# EAGLE design thaw (EAGLE 5.11)
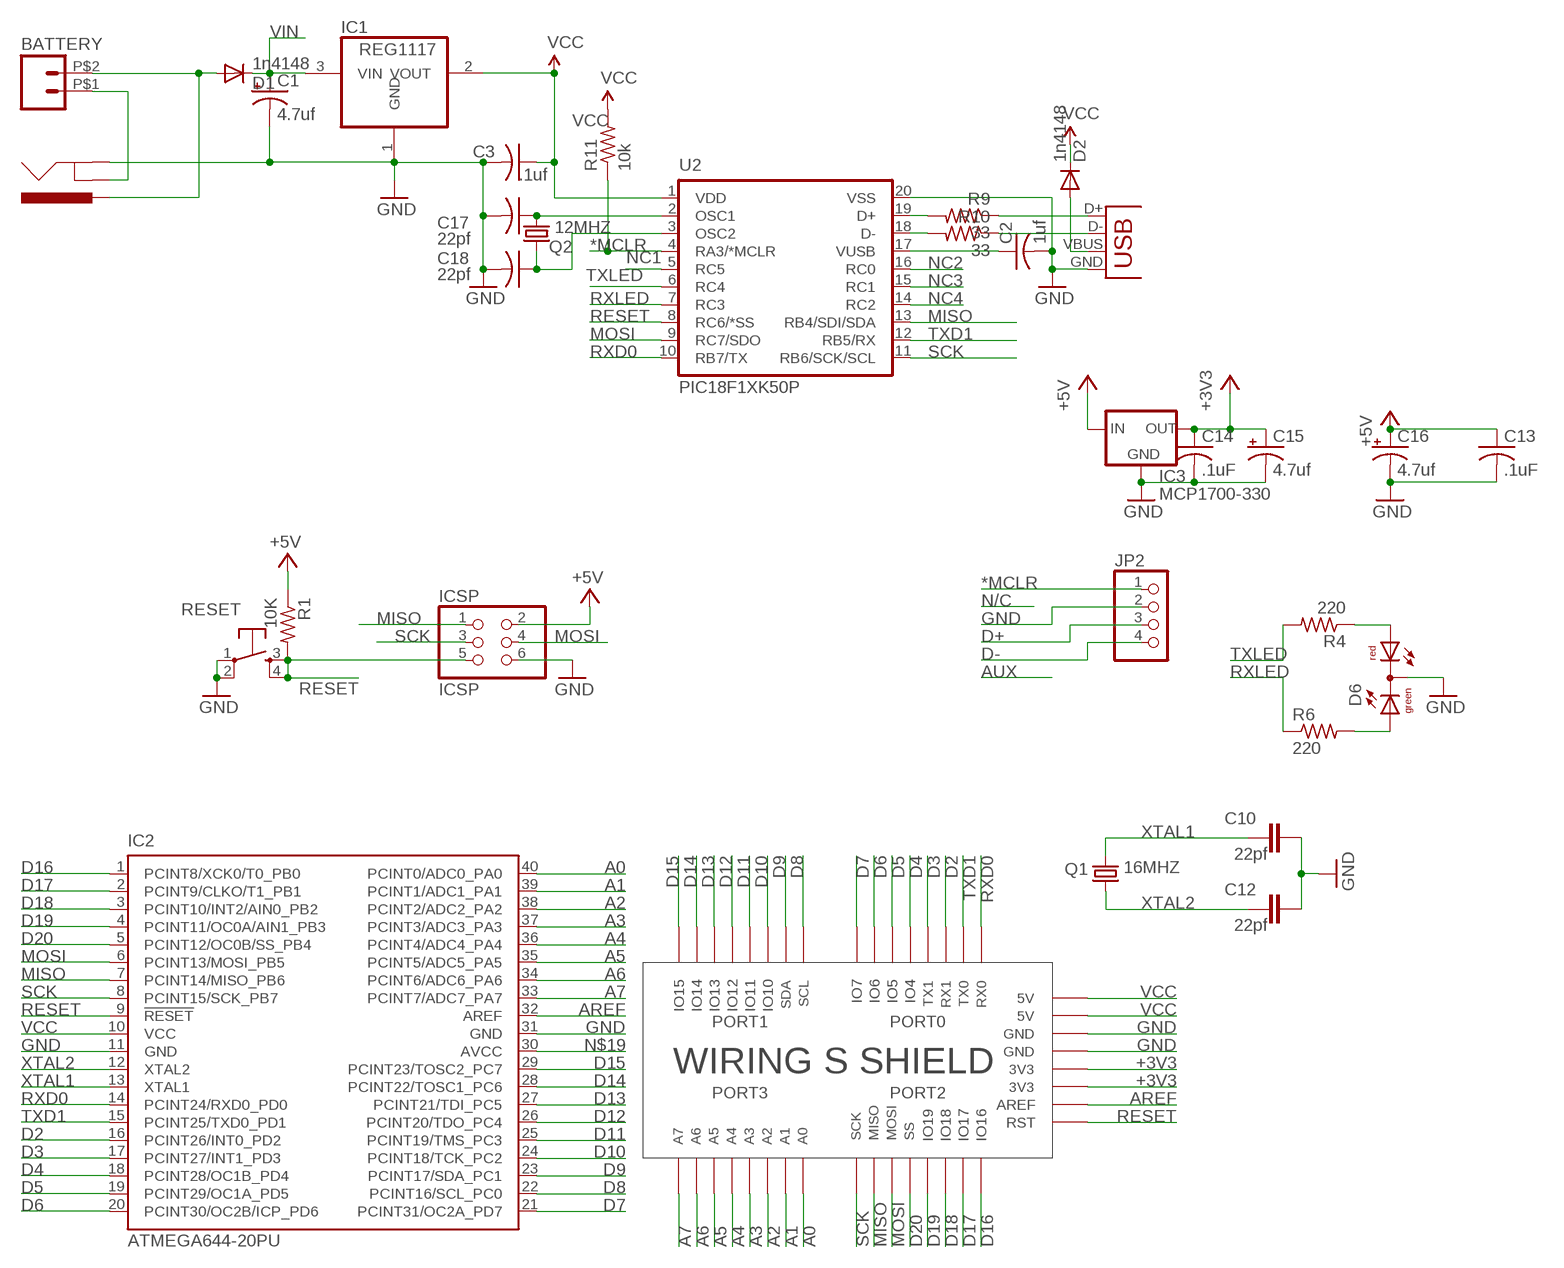
[diagram p0: schematic, sheet 1]

## Parts
BATTERY  M02  [1X02_BIG]
C1  4.7uf  CPOL-USE2.5-5  [E2,5-5]
C2  1uf  C-US025-030X050  [C025-030X050]
C3  .1uf  C-US025-030X050  [C025-030X050]
C10  22pf  C-EU025-025X050  [C025-025X050]
C12  22pf  C-EU025-025X050  [C025-025X050]
C13  .1uF  C-US025-025X050  [C025-025X050]
C14  .1uF  C-US025-025X050  [C025-025X050]
C15  4.7uf  CPOL-USE2.5-5  [E2,5-5]
C16  4.7uf  CPOL-USE2.5-5  [E2,5-5]
C17  22pf  C-US025-030X050  [C025-030X050]
C18  22pf  C-US025-030X050  [C025-030X050]
D1  1n4148  DIODEPTH2  [DOIDE-1N4148]
D2  1n4148  DIODEPTH2  [DOIDE-1N4148]
D6  DUOLED2X5  [DUOLED2X5]
IC1  REG1117  [SOT223]
IC2  ATMEGA644-20PU  [DIL40]
IC3  MCP1700-330  MCP1700TRI  [TO92]
ICSP  ICSP  PINHD-2X3  [2X03]
J1  POWER_JACKPTH  [POWER_JACK_PTH]
JP2  PINHD-1X4  [1X04]
Q1  16MHZ  CRYSTALHC49S  [HC49/S]
Q2  12MHZ  CRYSTALHC49S  [HC49/S]
R1  10K  R-US_0204/5  [0204/5]
R4  220  R-US_0204/5  [0204/5]
R6  220  R-US_0204/5  [0204/5]
R9  33  R-US_0204/5  [0204/5]
R10  33  R-US_0204/5  [0204/5]
R11  10k  R-US_0204/5  [0204/5]
RESET  TAC_SWITCHPTH  [TACTILE-PTH]
U2  PIC18F1XK50P  PIC18F/LF1XK50P  [DIL20]
U$1  WIRINGSHIELD  [WIRINGSHIELD]
X3  USB-3DPTH  [USB-B-PTH]

## Nets
*MCLR: JP2.1 R11.1 U2.4(RA3/*MCLR)
+3V3: C14.1 C15.+ IC3.3(OUT) U$1.P$37(3V3) U$1.P$38(3V3)
A0: IC2.40(PCINT0/ADC0_PA0) U$1.P$25(IO24)
A1: IC2.39(PCINT1/ADC1_PA1) U$1.P$26(IO25)
A2: IC2.38(PCINT2/ADC2_PA2) U$1.P$27(IO26)
A3: IC2.37(PCINT3/ADC3_PA3) U$1.P$28(IO27)
A4: IC2.36(PCINT4/ADC4_PA4) U$1.P$29(IO28)
A5: IC2.35(PCINT5/ADC5_PA5) U$1.P$30(IO29)
A6: IC2.34(PCINT6/ADC6_PA6) U$1.P$31(IO30)
A7: IC2.33(PCINT7/ADC7_PA7) U$1.P$32(IO31)
AREF: IC2.32(AREF) U$1.P$39(AREF)
D2: IC2.16(PCINT26/INT0_PD2) U$1.P$3(IO2)
D3: IC2.17(PCINT27/INT1_PD3) U$1.P$4(IO3)
D4: IC2.18(PCINT28/OC1B_PD4) U$1.P$5(IO4)
D5: IC2.19(PCINT29/OC1A_PD5) U$1.P$6(IO5)
D6: IC2.20(PCINT30/OC2B/ICP_PD6) U$1.P$7(IO6)
D7: IC2.21(PCINT31/OC2A_PD7) U$1.P$8(IO7)
D8: IC2.22(PCINT16/SCL_PC0) U$1.P$9(IO8)
D9: IC2.23(PCINT17/SDA_PC1) U$1.P$10(IO9)
D10: IC2.24(PCINT18/TCK_PC2) U$1.P$11(IO10)
D11: IC2.25(PCINT19/TMS_PC3) U$1.P$12(IO11)
D12: IC2.26(PCINT20/TDO_PC4) U$1.P$13(IO12)
D13: IC2.27(PCINT21/TDI_PC5) U$1.P$14(IO13)
D14: IC2.28(PCINT22/TOSC1_PC6) U$1.P$15(IO14)
D15: IC2.29(PCINT23/TOSC2_PC7) U$1.P$16(IO15)
D16: IC2.1(PCINT8/XCK0/T0_PB0) U$1.P$17(IO16)
D17: IC2.2(PCINT9/CLKO/T1_PB1) U$1.P$18(IO17)
D18: IC2.3(PCINT10/INT2/AIN0_PB2) U$1.P$19(IO18)
D19: IC2.4(PCINT11/OC0A/AIN1_PB3) U$1.P$20(IO19)
D20: IC2.5(PCINT12/OC0B/SS_PB4) U$1.P$21(IO20)
D+: JP2.3 R9.2 U2.19(D+)
D-: JP2.4 R10.2 U2.18(D-)
GND: C1.- C2.2 C3.2 C10.1 C12.1 C13.2 C14.2 C15.- C16.- C17.2 C18.2 D6.K(C) IC1.1(GND) IC2.11(GND) IC2.31(GND) IC3.1(GND) ICSP.6 J1.GND JP2.2 RESET.1 RESET.2 U2.20(VSS) U$1.P$35(GND) U$1.P$36(GND) X3.GND
MISO: IC2.7(PCINT14/MISO_PB6) ICSP.1 U2.13(RB4/SDI/SDA) U$1.P$23(IO22)
MOSI: IC2.6(PCINT13/MOSI_PB5) ICSP.4 U2.9(RC7/SDO) U$1.P$22(IO21)
N$1: BATTERY.P$2 D1.A J1.PWR
N$2: D6.AR R4.1
N$3: C2.1 U2.17(VUSB)
N$8: R9.1 X3.D+
N$9: R10.1 X3.D-
N$10: C17.1 Q2.2 U2.2(OSC1)
N$11: D2.A X3.VBUS
N$12: BATTERY.P$1 J1.GNDBREAK
N$14: D6.AG R6.2
N$15: C18.1 Q2.1 U2.3(OSC2)
N$19: IC2.30(AVCC)
NC1: U2.5(RC5)
NC2: U2.16(RC0)
NC3: U2.15(RC1)
NC4: U2.14(RC2)
RESET: IC2.9(!RESET) ICSP.5 R1.2 RESET.3 RESET.4 U2.8(RC6/*SS) U$1.P$40(RST)
RXD0: IC2.14(PCINT24/RXD0_PD0) U2.10(RB7/TX) U$1.P$1(IO0)
RXLED: R6.1 U2.7(RC3)
SCK: IC2.8(PCINT15/SCK_PB7) ICSP.3 U2.11(RB6/SCK/SCL) U$1.P$24(IO23)
TXD1: IC2.15(PCINT25/TXD0_PD1) U2.12(RB5/RX) U$1.P$2(IO1)
TXLED: R4.2 U2.6(RC4)
VCC: C3.1 C13.1 C16.+ D2.C IC1.2(VOUT) IC2.10(VCC) IC3.2(IN) ICSP.2 R1.1 R11.2 U2.1(VDD) U$1.P$33(5V) U$1.P$34(5V) ; supply symbol labelled +5V
VIN: C1.+ D1.C IC1.3(VIN)
XTAL1: C10.2 IC2.13(XTAL1) Q1.2
XTAL2: C12.2 IC2.12(XTAL2) Q1.1

## Library data of the parts
BATTERY = 3d:M02: Header 2 Standard 2-pin 0.1" header. Use with straight break away headers (SKU : PRT-00116), right angle break away headers (PRT-00553), swiss pins (PRT-00743), machine pins (PRT-00117), and female headers (PRT-00115). Molex polarized connector foot print use with SKU : PRT-08233 with associated crimp pins and housings.
C1 C15 C16 = adafruit:CPOL-US: POLARIZED CAPACITOR, American symbol
C2 C3 C17 C18 = rcl:C-US: CAPACITOR, American symbol
C10 C12 = SmartPrj:C-EU: CAPACITOR, European symbol
C13 C14 = adafruit:C-US: CAPACITOR, American symbol
D1 D2 = 3d:DIODE: Diode These are standard reverse protection diodes and small signal diodes. SMA package can handle up to about 1A. SOD-323 can handle about 200mA. What the SOD-323 package when ordering, there are some mfgs out there that are 5-pin packages.
D6 = led:DUOLED2X5: DUO LED 2 colors, 2.5 x 5 mm, recangle
IC1 = burr-brown:REG1117: 800mA and 1A Low Dropout (LDO) Positive Regulator 1.8V, 2.5V, 2.85V, 3.3V, 5V, and Adj; MPN: REG1117; OC_FARNELL: 1097566; OC_NEWARK: 14P6981
IC2 = atmel:ATMEGA644-*PU: 8-bit Microcontroller with 64K Bytes In-System Programmable Flash Auto generated by make-symbol-device-package-bsdl.ulp Rev. 34 Source: http://www.atmel.com/dyn/resources/prod_documents/doc2593.pdf; MPN: ATMEGA644-20PU; OC_FARNELL: 1288340; OC_NEWARK: 23M5060
IC3 = adafruit:MCP1700: VOLTAGE REGULATOR
ICSP = pinhead:PINHD-2X3: PIN HEADER
J1 = 3d:POWER_JACK: Power Jack This is the standard 5.5mm barrel jack for power. The PTH is the most common, proven, reliable, footprint. All others are experimental. The Slot footprint only works if the mill layer is transmitted to the PCB fab house so be warned. Spark Fun Electronics SKU : PRT-00119. Mating wall wart : TOL-00298 (and others)
JP2 = 3d2010:PINHD-1X4: PIN HEADER
Q1 Q2 = crystal:CRYSTAL: CRYSTAL
R1 R4 R6 = adafruit:R-US_: RESISTOR, American symbol
R9 R10 = rcl:R-US_: RESISTOR, American symbol
R11 = resistor:R-US_: RESISTOR, American symbol
RESET = 3d:TAC_SWITCH: Momentary Switch Button commonly used for reset or general input. Spark Fun Electronics SKU : COM-00097
U2 = mcp2200plus:PIC18F/LF1XK50: 20 pin USB flash Microcontroller.
U$1 = 3d2011:WIRINGSHIELD: Wiring S Shield
X3 = 3d2010:USB-3D: USB Connectors USB-B-PTH is fully proven SKU : PRT-00139 USB-miniB is fully proven SKU : PRT-00587 USB-A-PCB is untested. USB-A-H is throughly reviewed, but untested. Spark Fun Electronics SKU : PRT-00437 USB-B-SMT is throughly reviewed, but untested. Needs silkscreen touching up. USB-A-S has not been used/tested USB-MB-H has not been used/tested

## Net classes
0 default: width 0.203 mm
1 vcc: width 0.254 mm

## Board
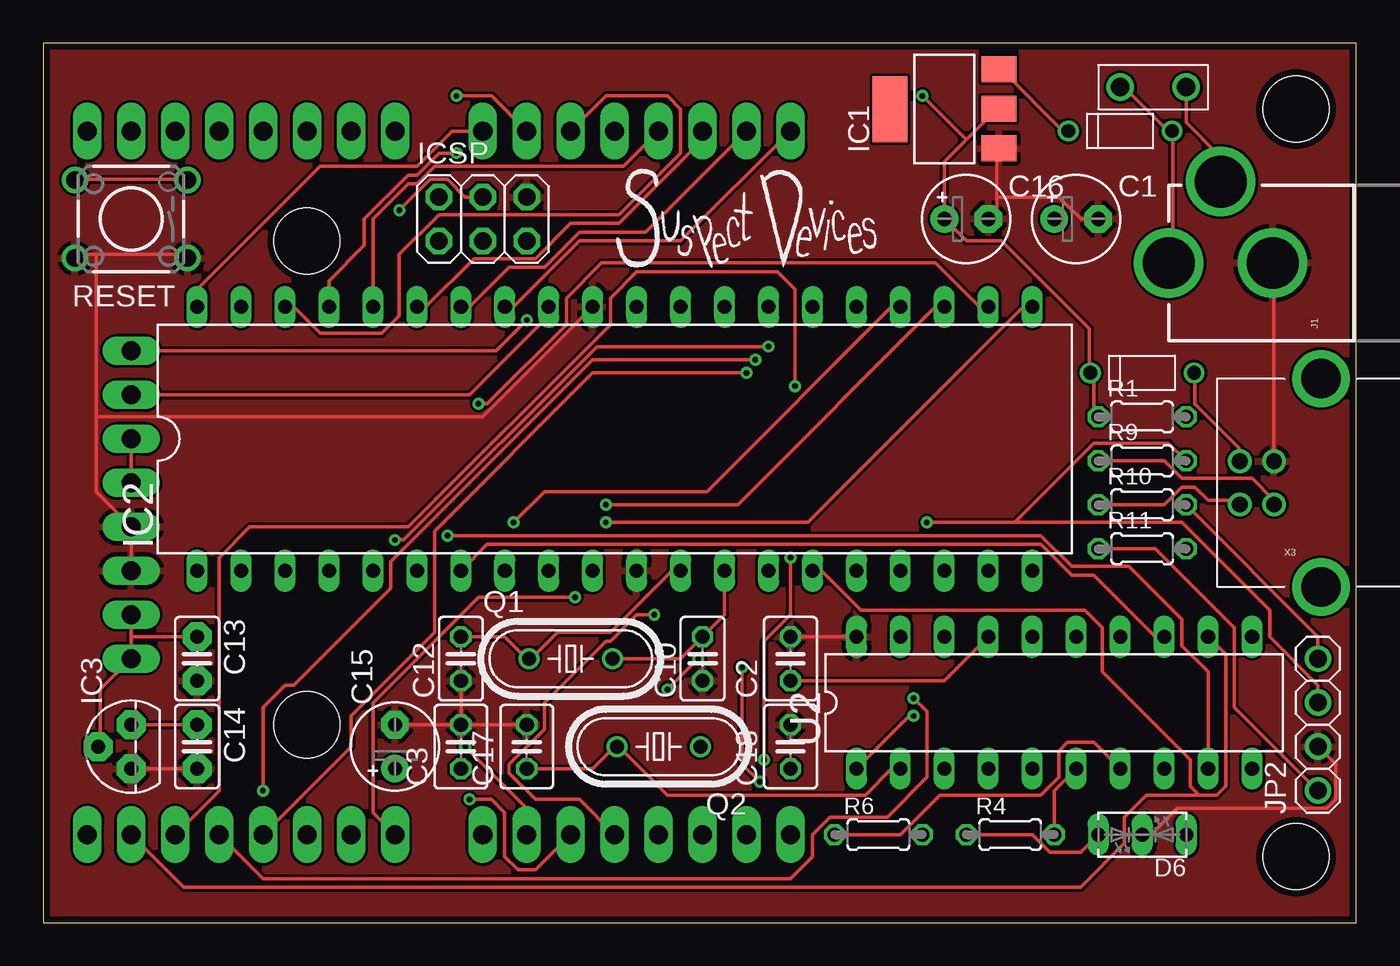
[diagram p1: board, top side]
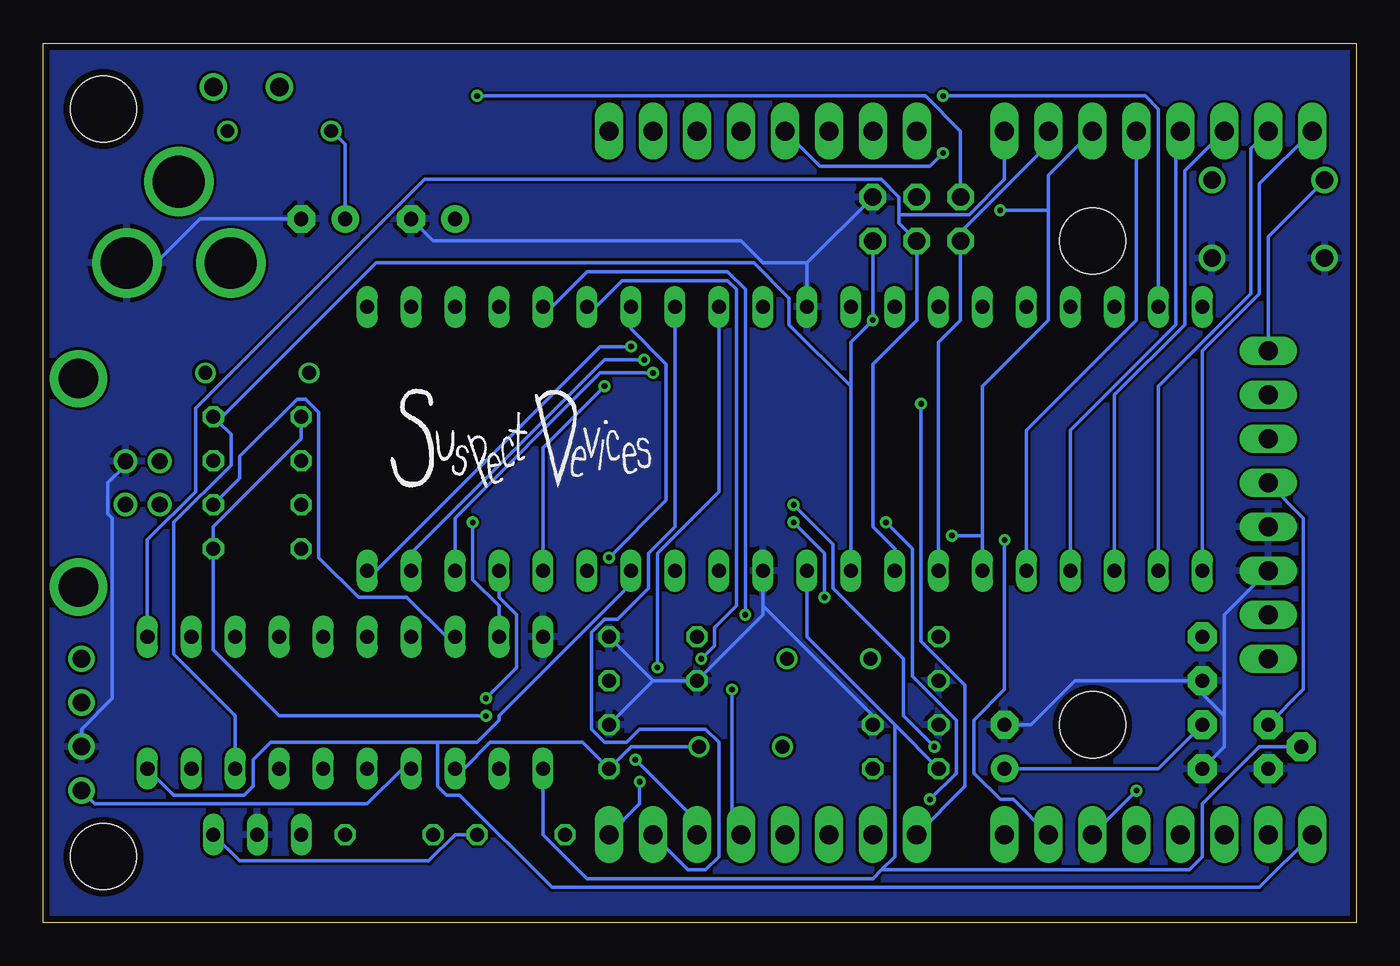
[diagram p2: board, bottom side, seen from below]

Size 75.87 x 50.79 mm. Coordinates in mm from the lower left corner, seen from the top.
Outline: 0,0 75.87,0 75.87,50.79 0,50.79 0,0
Copper layers (1*16): Top 0.0356mm / dielectric 1.5011mm / Bottom 0.0356mm
Design rules "LaenPCBOrder": minimum track width 6mil, minimum drill 13mil, track to track 6mil, track to pad 6mil, pad to pad 6mil, via to via 6mil, smd to smd 6mil, copper to edge 15mil, drill to drill 6mil, minimum pad ring 7mil, minimum via ring 7mil, stop-mask expansion 4mil, vias tented up to drill 0mil, thermal gap 10mil

### Footprints (pad centres in the part's own frame; a part is rotated, then mirrored left to right if it is on the bottom)
1X02_BIG = drill 1.067 round: P$1 0,0; P$2 3.81,0
E2,5-5 = drill 0.813 pad 1.6 round: + -1.27,0 | drill 0.813 pad 1.6 octagon: - 1.27,0
C025-030X050 = drill 0.813 octagon: 1 -1.27,0; 2 1.27,0
C025-025X050 = drill 0.813 octagon: 1 -1.27,0; 2 1.27,0
C025-025X050' = drill 0.813 pad 1.676 octagon: 1 -1.27,0; 2 1.27,0
DOIDE-1N4148 = drill 0.8 round: A 3,0; C -3,0
DUOLED2X5 = drill 0.813 long: AG -2.54,0; AR 2.54,0; K 0,0
SOT223 = smd 1.499 x 2.007: 1 -2.261,-3.15; 2 0.025,-3.15; 3 2.311,-3.15 | smd 3.81 x 2.007: 4 0,3.15
DIL40 = drill 0.813 long: 1 -24.13,-7.62; 2 -21.59,-7.62; 3 -19.05,-7.62; 4 -16.51,-7.62; 5 -13.97,-7.62; 6 -11.43,-7.62; 7 -8.89,-7.62; 8 -6.35,-7.62; 9 -3.81,-7.62; 10 -1.27,-7.62; 11 1.27,-7.62; 12 3.81,-7.62; 13 6.35,-7.62; 14 8.89,-7.62; 15 11.43,-7.62; 16 13.97,-7.62; 17 16.51,-7.62; 18 19.05,-7.62; 19 21.59,-7.62; 20 24.13,-7.62; 21 24.13,7.62; 22 21.59,7.62; 23 19.05,7.62; 24 16.51,7.62; 25 13.97,7.62; 26 11.43,7.62; 27 8.89,7.62; 28 6.35,7.62; 29 3.81,7.62; 30 1.27,7.62; 31 -1.27,7.62; 32 -3.81,7.62; 33 -6.35,7.62; 34 -8.89,7.62; 35 -11.43,7.62; 36 -13.97,7.62; 37 -16.51,7.62; 38 -19.05,7.62; 39 -21.59,7.62; 40 -24.13,7.62
TO92 = drill 0.813 pad 1.676 octagon: 1 -1.27,0; 2 0,1.905; 3 1.27,0
2X03 = drill 1.016 octagon: 1 -2.54,-1.27; 2 -2.54,1.27; 3 0,-1.27; 4 0,1.27; 5 2.54,-1.27; 6 2.54,1.27
POWER_JACK_PTH = drill 2.997 round: GND 0,7.7; GNDBREAK 4.7,10.7; PWR 0,13.7
1X04 = drill 1.016 round: 1 -3.81,0; 2 -1.27,0; 3 1.27,0; 4 3.81,0
HC49/S = drill 0.813 round: 1 -2.413,0; 2 2.413,0
0204/5 = drill 0.813 octagon: 1 -2.54,0; 2 2.54,0
TACTILE-PTH = drill 1.016 round: 1 -3.251,2.261; 2 3.251,2.261; 3 -3.251,-2.261; 4 3.251,-2.261
DIL20 = drill 0.813 long: 1 -11.43,-3.81; 2 -8.89,-3.81; 3 -6.35,-3.81; 4 -3.81,-3.81; 5 -1.27,-3.81; 6 1.27,-3.81; 7 3.81,-3.81; 8 6.35,-3.81; 9 8.89,-3.81; 10 11.43,-3.81; 11 11.43,3.81; 12 8.89,3.81; 13 6.35,3.81; 14 3.81,3.81; 15 1.27,3.81; 16 -1.27,3.81; 17 -3.81,3.81; 18 -6.35,3.81; 19 -8.89,3.81; 20 -11.43,3.81
WIRINGSHIELD = drill 1.1 pad 1.422 long: P$1 2.54,5.08; P$2 5.08,5.08; P$3 7.62,5.08; P$4 10.16,5.08; P$5 12.7,5.08; P$6 15.24,5.08; P$7 17.78,5.08; P$8 20.32,5.08; P$9 25.4,5.08; P$10 27.94,5.08; P$11 30.48,5.08; P$12 33.02,5.08; P$13 35.56,5.08; P$14 38.1,5.08; P$15 40.64,5.08; P$16 43.18,5.08; P$17 2.54,45.72; P$18 5.08,45.72; P$19 7.62,45.72; P$20 10.16,45.72; P$21 12.7,45.72; P$22 15.24,45.72; P$23 17.78,45.72; P$24 20.32,45.72; P$25 25.4,45.72; P$26 27.94,45.72; P$27 30.48,45.72; P$28 33.02,45.72; P$29 35.56,45.72; P$30 38.1,45.72; P$31 40.64,45.72; P$32 43.18,45.72; P$33 5.08,15.24; P$34 5.08,17.78; P$35 5.08,20.32; P$36 5.08,22.86; P$37 5.08,25.4; P$38 5.08,27.94; P$39 5.08,30.48; P$40 5.08,33.02 | hole 3.81: 15.24,11.43; 15.24,39.37; 72.39,46.99; 72.39,3.81
USB-B-PTH = drill 0.914 round: D+ 0,1.25; D- 1.981,1.25; GND 0,-1.25; VBUS 1.981,-1.25 | drill 2.286 round: P$1 -2.718,-6.02; P$2 -2.718,6.02

### Placement (x,y rotation side)
BATTERY  66.04,48.26 180 top
C1  59.69,40.64 0 top
C2  43.18,15.24 90 top
C3  24.13,10.16 90 top
C10  38.1,15.24 90 top
C12  24.13,15.24 90 top
C13  .1uF  [C025-025X050']  8.89,15.24 270 top
C14  .1uF  [C025-025X050']  8.89,10.16 270 top
C15  20.32,10.16 90 top
C16  53.34,40.64 0 top
C17  27.94,10.16 90 top
C18  43.18,10.16 90 top
D1  62.23,45.72 0 top
D2  63.5,31.75 0 top
D6  63.5,5.08 180 top
IC1  52.07,46.99 90 top
IC2  33.02,27.94 0 top
IC3  5.08,10.16 90 top
ICSP  25.4,40.64 0 top
J1  78.74,38.1 90 top
JP2  73.66,11.43 90 top
Q1  30.48,15.24 0 top
Q2  35.56,10.16 180 top
R1  63.5,29.21 0 top
R4  55.88,5.08 0 top
R6  48.26,5.08 0 top
R9  63.5,26.67 0 top
R10  63.5,24.13 0 top
R11  63.5,21.59 0 top
RESET  5.08,40.64 180 top
U2  58.42,12.7 0 top
U$1  0,0 0 top
U$2  [SUSDEVLOGOSM]  33.02,38.1 0 top
U$3  [SUSDEVLOGOSM]  55.88,25.4 0 bottom
X3  71.12,25.4 180 top

### Tracks (layer width: path | path; a pad name or v marks a point on that pad's centre or on a via)
*MCLR
  Top 0.203: R11.1 64.26,21.59 68.83,17.02 68.83,12.45 JP2.1
  Bottom 0.203: U2.4 55.12,8.89 57.15,6.86 72.9,6.86 JP2.1
+3V3
  Top 0.203: U$1.P$37 U$1.P$38 | IC3.3 C14.1
  Bottom 0.203: C15.+ 11.43,8.89 C14.1 | U$1.P$37 3.05,23.37 3.05,13.46 IC3.3
A0
  Top 0.203: IC2.40 8.89,36.58 16,43.69 21.59,43.69 23.62,45.72 U$1.P$25
A1  (via drill 0.33)
  Top 0.203: v23.88,47.75 25.91,47.75 U$1.P$26
  Bottom 0.203: IC2.39 11.43,46.99 12.19,47.75 v23.88,47.75
A2
  Top 0.203: IC2.38 14.48,35.56 16,34.04 19.56,34.04 20.57,35.05 20.57,38.61 22.86,40.89 33.27,40.89 36.83,44.45 36.83,46.99 36.07,47.75 32.51,47.75 U$1.P$27
A3  (via drill 0.33)
  Top 0.203: IC2.37 16.51,37.08 18.54,39.12 18.54,40.64 21.08,43.18 21.59,43.18 22.86,44.45 v23.88,44.45
  Bottom 0.203: v23.88,44.45 24.64,43.69 30.99,43.69 U$1.P$28
A4
  Top 0.203: IC2.36 19.05,40.64 21.08,42.67 21.59,42.67 22.61,43.69 33.53,43.69 U$1.P$29
A5
  Top 0.203: IC2.35 22.1,35.56 24.89,38.35 28.45,38.35 30.48,40.39 33.27,40.39 38.1,45.21 U$1.P$30
A6
  Top 0.203: IC2.34 24.64,35.56 26.92,37.85 28.96,37.85 30.99,39.88 34.8,39.88 U$1.P$31
A7
  Top 0.203: IC2.33 27.18,35.56 30.99,39.37 36.83,39.37 U$1.P$32
AREF
  Top 0.203: IC2.32 29.21,35.05 24.64,30.48 U$1.P$39
D2  (via drill 0.33)
  Top 0.203: v43.43,30.99 43.43,36.58 42.42,37.59 34.29,37.59 32.77,36.07 32.77,34.54 21.08,22.86 11.94,22.86 10.16,21.08 10.16,7.62 U$1.P$3
  Bottom 0.203: IC2.16 46.99,27.43 v43.43,30.99
D3  (via drill 0.33)
  Top 0.203: v50.29,12.95 51.05,12.19 51.05,8.38 48.77,6.1 45.47,6.1 44.45,5.08 44.45,3.81 43.18,2.54 12.7,2.54 U$1.P$4
  Bottom 0.203: IC2.17 49.53,18.8 48.51,17.78 48.51,14.73 v50.29,12.95
D4  (via drill 0.33)
  Top 0.203: v40.64,31.75 31.75,31.75 22.61,22.61 22.61,16.76 17.78,11.94 17.78,10.16 U$1.P$5
  Bottom 0.203: IC2.18 52.07,23.37 43.69,31.75 v40.64,31.75
D5  (via drill 0.33)
  Top 0.203: v41.15,32.51 31.75,32.51 20.07,20.83 20.07,19.3 14.48,13.72 13.97,13.72 12.7,12.45 v12.7,7.62
  Bottom 0.203: IC2.19 54.61,21.34 43.43,32.51 v41.15,32.51 | U$1.P$6 v12.7,7.62
D6  (via drill 0.33)
  Top 0.203: v41.91,33.27 32,33.27 20.83,22.1 v20.32,22.1
  Bottom 0.203: IC2.20 56.64,20.32 43.69,33.27 v41.91,33.27 | v20.32,22.1 20.32,13.46 22.1,11.68 22.1,8.64 20.57,7.11 19.81,7.11 U$1.P$7
D7  (via drill 0.33)
  Top 0.203: IC2.21 56.64,35.56 44.2,23.11 v32.51,23.11 | v30.73,18.8 25.15,18.8 19.05,12.7 19.05,6.35 U$1.P$8
  Bottom 0.203: v32.51,23.11 30.73,21.34 v30.73,18.8
D8  (via drill 0.33)
  Top 0.203: IC2.22 54.1,35.56 51.56,38.1 32.26,38.1 30.23,36.07 30.23,34.54 25.65,29.97 v25.15,29.97
  Bottom 0.203: v25.15,29.97 25.15,16.26 22.61,13.72 22.61,7.87 U$1.P$9
D9  (via drill 0.33)
  Top 0.203: IC2.23 51.56,35.56 40.13,24.13 v32.51,24.13 | v24.38,10.16 27.94,6.6 U$1.P$10
  Bottom 0.203: v32.51,24.13 30.23,21.84 30.23,19.3 26.16,15.24 26.16,11.94 v24.38,10.16
D10  (via drill 0.33)
  Top 0.203: IC2.24 49.02,35.56 38.35,24.89 28.96,24.89 v27.18,23.11 | v24.64,7.11 25.91,7.11 26.67,6.35 26.67,3.81 27.43,3.05 28.45,3.05 U$1.P$11
  Bottom 0.203: v27.18,23.11 25.65,21.59 25.65,14.22 23.11,11.68 23.11,8.64 v24.64,7.11
D11  (via drill 0.33)
  Top 0.203: v35.31,17.78 34.29,17.78 32.77,16.26 32.51,16.26 28.96,12.7 28.96,11.18 26.92,9.14 26.92,8.64 28.45,7.11 30.99,7.11 U$1.P$12
  Bottom 0.203: IC2.25 46.48,35.56 44.45,37.59 36.32,37.59 35.31,36.58 v35.31,17.78
D12  (via drill 0.33)
  Top 0.203: v36.07,13.46 v37.85,15.24
  Bottom 0.203: IC2.26 43.94,35.56 42.42,37.08 36.32,37.08 35.81,36.58 35.81,18.29 37.08,17.02 37.08,16 v37.85,15.24 | v36.07,13.46 36.07,5.59 U$1.P$13
D13  (via drill 0.33)
  Top 0.203: v43.18,21.08 43.18,17.78 41.66,16.26 v41.66,9.4
  Bottom 0.203: IC2.27 41.91,34.29 39.88,32.26 39.88,24.38 v43.18,21.08 | v41.66,9.4 38.1,5.84 U$1.P$14
D14
  Bottom 0.203: IC2.28 39.37,22.86 40.89,21.34 40.89,19.3 42.67,17.53 43.43,17.53 44.2,16.76 44.2,11.18 43.43,10.41 42.16,10.41 41.4,11.18 37.59,11.18 36.83,10.41 36.83,3.81 37.59,3.05 38.61,3.05 U$1.P$15
D15  (via drill 0.33)
  Top 0.203: v40.39,14.73 40.39,9.14 v41.4,8.13
  Bottom 0.203: IC2.29 36.83,24.89 40.39,21.34 v40.39,14.73 | v41.4,8.13 41.4,6.86 U$1.P$16
D16
  Bottom 0.203: IC2.1 8.89,33.02 5.59,36.32 5.59,42.67 U$1.P$17
D17
  Bottom 0.203: IC2.2 11.43,30.99 6.1,36.32 6.1,44.7 U$1.P$18
D18
  Bottom 0.203: IC2.3 13.97,30.48 9.91,34.54 9.91,43.43 U$1.P$19
D19
  Bottom 0.203: IC2.4 16.51,28.45 10.41,34.54 10.41,45.47 U$1.P$20
D20
  Bottom 0.203: IC2.5 19.05,28.45 12.7,34.8 U$1.P$21
D+  (via drill 0.33)
  Top 0.203: v51.05,23.11 56.13,23.11 | 56.13,23.11 60.71,27.69 65.02,27.69 R9.2 | JP2.3 73.66,13.72 70.87,16.51 70.87,18.03 65.79,23.11 56.13,23.11
  Bottom 0.203: U2.19 49.53,18.29 51.05,19.81 v51.05,23.11
D-
  Top 0.203: JP2.4 73.66,16.51 R10.2
  Bottom 0.203: U2.18 52.58,16.51 54.86,18.8 57.66,18.8 59.94,21.08 59.94,29.46 60.71,30.23 61.21,30.23 64.52,26.92 64.52,25.65 R10.2
GND
  Top 0.203: C3.2 C12.1 | C3.2 C17.2 | C15.- C3.2 | C2.2 U2.20 | 3.05,38.61 8.13,38.61 RESET.1 | 3.05,38.61 2.03,38.61 RESET.2 | U$1.P$35 U$1.P$36 3.05,24.89 3.05,29.21 | IC3.1 C14.2 | 3.05,29.21 3.05,38.61 | 55.12,41.91 55.12,41.15 C16.- | 55.12,41.91 55.12,44.7 IC1.1 | C1.- 59.94,40.64 58.67,41.91 55.12,41.91 | D6.K 64.01,5.08 65.53,6.6 74.17,6.6 74.68,7.11 74.68,9.14 JP2.2 | X3.GND 71.12,38.1 J1.GND | 3.05,29.21 25.4,29.21 IC2.31
  Bottom 0.203: 40.64,13.97 C10.1 34.29,17.78 34.29,18.29 | 40.64,13.97 C2.2 | 40.64,13.97 C18.2 | 34.29,18.29 IC2.11 | C17.2 27.94,11.94 34.29,18.29 | 7.62,11.94 8.89,13.21 C13.2 16.26,13.97 18.8,11.43 C15.- | 7.62,11.94 7.62,10.16 C14.2 | U$1.P$35 7.62,17.78 7.62,11.94 | IC2.31 31.75,38.1 | 31.75,38.1 ICSP.6 | 31.75,38.1 34.29,38.1 35.56,39.37 53.34,39.37 C16.- | JP2.2 73.66,11.18 71.88,12.95 71.88,23.37 72.14,23.62 72.14,25.4 71.12,26.42 X3.GND | C1.- 66.8,40.64 69.34,38.1 J1.GND
  pour Bottom: 0,50.8 76.2,50.8 76.2,0 0,0
  pour Top: 0,50.8 76.2,50.8 76.2,0 0,0
MISO
  Top 0.203: U2.13 64.26,16.51 60.71,20.07 59.44,20.07 57.66,21.84 25.65,21.84 IC2.7
  Bottom 0.203: IC2.7 24.13,33.53 22.86,34.8 ICSP.1 22.86,39.88 17.78,44.96 U$1.P$23
MOSI  (via drill 0.33)
  Top 0.203: U2.9 67.31,14.48 65.79,16 65.79,17.53 62.74,20.57 59.44,20.57 57.66,22.35 v23.37,22.35 | ICSP.4 24.38,41.91 23.37,42.93 22.35,42.93 v20.57,41.15
  Bottom 0.203: 21.59,22.35 21.59,30.99 17.78,34.8 17.78,41.15 | IC2.6 21.59,22.35 | 17.78,41.15 17.78,43.18 U$1.P$22 | 21.59,22.35 v23.37,22.35 | 17.78,41.15 v20.57,41.15
N$1
  Top 0.203: BATTERY.P$2 62.48,48.26 65.02,45.72 D1.A 65.28,45.72 65.28,38.1 J1.PWR
N$2
  Top 0.203: R4.1 57.15,5.08 58.17,4.06 59.94,4.06 D6.AR
N$3
  Top 0.203: C2.1 52.07,13.97 U2.17
N$8
  Top 0.203: R9.1 64.77,26.67 65.79,25.65 69.85,25.65 71.12,24.38 X3.D+
N$9
  Top 0.203: R10.1 64.77,24.13 65.79,25.15 66.55,25.15 67.31,24.38 69.09,24.38 X3.D-
N$10
  Top 0.203: C17.1 31.75,8.89 33.02,10.16 Q2.2 33.27,10.16 36.07,7.37 47.5,7.37 49.02,8.89 U2.2
N$11
  Top 0.203: D2.A 66.55,31.75 66.55,29.97 69.09,27.43 69.09,26.67 X3.VBUS
N$12
  Top 0.203: BATTERY.P$1 66.04,46.23 67.82,44.45 67.82,42.93 J1.GNDBREAK
N$14
  Bottom 0.203: R6.2 52.07,5.08 53.59,3.56 64.52,3.56 D6.AG
N$15
  Bottom 0.203: Q2.1 41.91,10.16 C18.1 44.7,10.41 50.04,10.41 51.56,8.89 U2.3
RESET  (via drill 0.33)
  Top 0.203: RESET.4 2.03,42.93 8.13,42.93 RESET.3 | U$1.P$40 26.16,33.02 v27.94,34.8
  Bottom 0.203: U2.8 64.77,11.94 68.33,15.49 68.33,23.11 65.02,26.42 65.02,28.19 65.79,28.96 | U$1.P$40 5.08,39.62 2.03,42.67 RESET.4 | 29.21,30.99 29.21,33.53 v27.94,34.8 ICSP.5 | 29.21,30.99 IC2.9 | 65.79,28.96 56.64,38.1 34.8,38.1 32.77,36.07 32.77,34.54 29.21,30.99 | 65.79,28.96 R1.2
RXD0
  Bottom 0.203: IC2.14 41.91,19.56 49.53,11.94 49.53,11.68 50.8,10.41 53.09,10.41 | 53.09,10.41 62.74,10.41 63.75,9.4 63.75,7.87 64.26,7.37 68.33,7.37 U2.10 | U$1.P$1 5.59,2.03 46.48,2.03 51.82,7.37 52.58,7.37 53.09,7.87 53.09,10.41
RXLED
  Top 0.203: R6.1 49.53,5.08 51.82,7.37 57.66,7.37 58.67,8.38 58.67,9.91 59.18,10.41 60.71,10.41 U2.7
SCK
  Bottom 0.203: U2.11 69.85,22.1 67.06,24.89 67.06,29.72 53.85,42.93 27.43,42.93 26.42,41.91 26.42,40.89 | 26.42,40.89 26.42,40.39 ICSP.3 25.4,34.8 27.94,32.26 27.94,22.86 26.67,21.59 IC2.8 | U$1.P$24 20.32,42.93 22.35,40.89 26.42,40.89
TXD1
  Top 0.203: IC2.15 44.96,20.32 47.24,18.03 60.2,18.03 61.21,17.02 61.21,14.48 66.29,9.4 66.29,7.87 66.8,7.37 | 66.8,7.37 67.82,7.37 68.33,7.87 68.33,15.49 U2.12 | U$1.P$2 8.13,2.03 59.94,2.03 62.48,4.57 62.48,6.1 63.75,7.37 66.8,7.37
TXLED
  Top 0.203: R4.2 58.42,7.62 U2.6
VCC  (via drill 0.33)
  Top 0.203: 5.08,16.51 U$1.P$34 | 5.08,16.51 U$1.P$33 3.3,13.46 3.3,10.16 IC3.2 | 5.08,16.51 C13.1 | R1.1 60.71,29.46 60.71,31.75 D2.C 60.45,31.75 60.45,34.29 55.37,39.37 53.34,39.37 C16.+ 52.07,43.94 53.34,45.21 | 53.34,45.21 55.12,46.99 IC1.2 | 53.34,45.21 v50.8,47.75 | U2.1 50.04,11.94 v50.29,11.94
  Bottom 0.203: 26.67,11.43 31.75,16.51 IC2.10 | 26.67,11.43 C3.1 | U2.1 46.99,5.08 44.45,2.54 27.94,2.54 27.43,3.05 | 27.43,3.05 26.67,3.81 26.67,11.43 | 27.43,3.05 9.65,3.05 8.89,3.81 8.89,6.86 5.59,10.16 IC3.2 | R1.1 60.96,27.94 66.04,22.86 R11.2 66.04,15.75 62.23,11.94 v50.29,11.94 | ICSP.2 22.86,45.72 24.89,47.75 v50.8,47.75
VIN
  Top 0.203: IC1.3 55.37,49.28 58.93,45.72 D1.C
  Bottom 0.203: C1.+ 58.42,44.96 59.18,45.72 D1.C
XTAL1
  Top 0.203: Q1.2 36.83,15.24 C10.2 39.37,17.78 IC2.13
XTAL2
  Top 0.203: C12.2 26.67,16.51 27.94,15.24 Q1.1 28.19,15.24 29.72,16.76 32.77,16.76 36.32,20.32 IC2.12